# Altium schematic sheet DHT11.SchDoc
size 279 x 254 mm; SheetNumber: 1; SheetTotal: 1
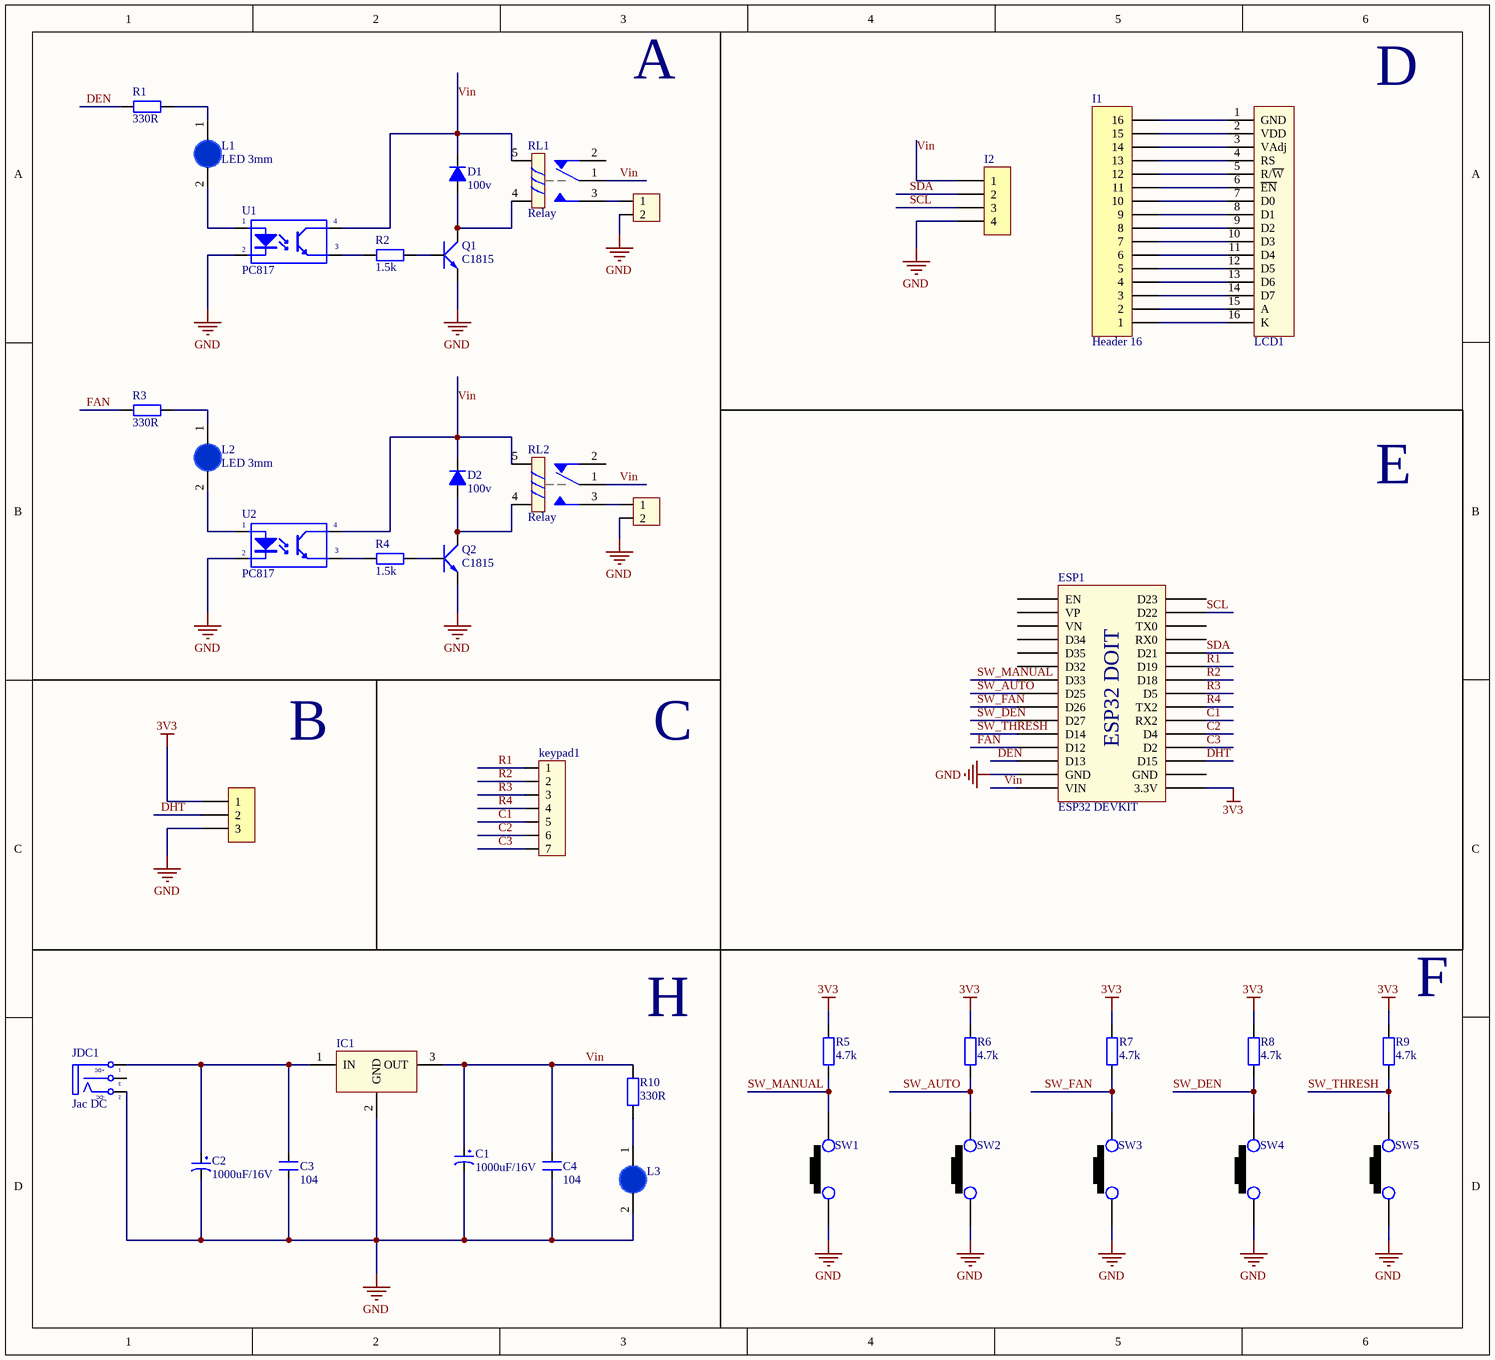
[diagram p0: DHT11.SchDoc]

## Parts
C1  1000uF/16V  [CP1.5/3.4]
C2  1000uF/16V  [CP1.5/3.4]
C3  104  [CN2]
C4  104  [CN2]
D1  100v  [DIODE 1A]
D2  100v  [DIODE 1A]
ESP1  ESP32 DEVKIT  [ESP32 WROOM 32 KIT]
H1  Header 2P 2.54 Duc Thang  [XH2.54M-2]  (value not drawn)
H2  Header 2P 2.54 Duc Thang  [XH2.54M-2]  (value not drawn)
H3  Header 3P 2.54 Duc Thang  [XH2.54M-3]  (value not drawn)
I1  Header 16  [HDR1X16]
I2  Header 4P 2.54 Duc Thang  [XH2.54M-4]  (value not drawn)
IC1  LM7805  [QTO-220]  (value not drawn)
JDC1  Jac DC  [DC-IN]
keypad1  Header 7P 2.54 Duc Thang  [XH2.54M-7]  (value not drawn)
L1  LED 3mm  [LED-3MM-BLUE]
L2  LED 3mm  [LED-3MM-BLUE]
L3  LED 3mm  [LED-3MM-BLUE]  (value not drawn)
LCD1  LCD1602 XL  [LCD1602 with Jump]  (value not drawn)
Q1  C1815  [TO92]
Q2  C1815  [TO92]
R1  330R  [tro vach 1/2w]
R2  1.5k  [tro vach 1/4w]
R3  330R  [tro vach 1/2w]
R4  1.5k  [tro vach 1/4w]
R5  4.7k  [tro vach 1/2w]
R6  4.7k  [tro vach 1/2w]
R7  4.7k  [tro vach 1/2w]
R8  4.7k  [tro vach 1/2w]
R9  4.7k  [tro vach 1/2w]
R10  330R  [tro vach 1/2w]
RL1  Relay  [Relay 5 Chan SRD]
RL2  Relay  [Relay 5 Chan SRD]
SW1  TACTILE SWITCH  [SW_342_SMD]  (value not drawn)
SW2  TACTILE SWITCH  [SW_342_SMD]  (value not drawn)
SW3  TACTILE SWITCH  [SW_342_SMD]  (value not drawn)
SW4  TACTILE SWITCH  [SW_342_SMD]  (value not drawn)
SW5  TACTILE SWITCH  [SW_342_SMD]  (value not drawn)
U1  PC817  [PC817]
U2  PC817  [PC817]

## Nets
3V3: ESP1.16(3.3V) H3.1 R5.2 R6.2 R7.2 R8.2 R9.2
GND: C1.2 C2.2 C3.1 C4.1 ESP1.14(GND) H1.2 H2.2 H3.3 I2.4 IC1.2(GND) JDC1.2(TN) L3.2(K) Q1.1(E) Q2.1(E) SW1.1 SW2.1 SW3.1 SW4.1 SW5.1 U1.2(K) U2.2(K)
C1: ESP1.21(RX2) keypad1.5
C2: ESP1.20(D4) keypad1.6
C3: ESP1.19(D2) keypad1.7
DEN: ESP1.13(D13) R1.1
DHT: ESP1.18(D15) H3.2
FAN: ESP1.12(D12) R3.1
R1: ESP1.25(D19) keypad1.1
R2: ESP1.24(D18) keypad1.2
R3: ESP1.23(D5) keypad1.3
R4: ESP1.22(TX2) keypad1.4
SCL: ESP1.29(D22) I2.3
SDA: ESP1.26(D21) I2.2
SW_AUTO: ESP1.8(D25) R6.1 SW2.2
SW_DEN: ESP1.10(D27) R8.1 SW4.2
SW_FAN: ESP1.9(D26) R7.1 SW3.2
SW_MANUAL: ESP1.7(D33) R5.1 SW1.2
SW_THRESH: ESP1.11(D14) R9.1 SW5.2
Vin: C1.1 C4.2 D1.2(K) D2.2(K) ESP1.15(VIN) I2.1 IC1.3(OUT) R10.1 RL1.1 RL1.5 RL2.1 RL2.5 U1.4(C) U2.4(C)
NetC2_1: C2.1 C3.2 IC1.1(IN) JDC1.1(T)
NetD1_1: D1.1(A) Q1.2(C) RL1.4
NetD2_1: D2.1(A) Q2.2(C) RL2.4
NetH1_1: H1.1 RL1.3
NetH2_1: H2.1 RL2.3
NetI1_1: I1.1 LCD1.16(K)
NetI1_2: I1.2 LCD1.15(A)
NetI1_3: I1.3 LCD1.14(D7)
NetI1_4: I1.4 LCD1.13(D6)
NetI1_5: I1.5 LCD1.12(D5)
NetI1_6: I1.6 LCD1.11(D4)
NetI1_7: I1.7 LCD1.10(D3)
NetI1_8: I1.8 LCD1.9(D2)
NetI1_9: I1.9 LCD1.8(D1)
NetI1_10: I1.10 LCD1.7(D0)
NetI1_11: I1.11 LCD1.6(~{EN})
NetI1_12: I1.12 LCD1.5(R/~{W})
NetI1_13: I1.13 LCD1.4(RS)
NetI1_14: I1.14 LCD1.3(VAdj)
NetI1_15: I1.15 LCD1.2(VDD)
NetI1_16: I1.16 LCD1.1(GND)
NetL1_1: L1.1(A) R1.2
NetL1_2: L1.2(K) U1.1(A)
NetL2_1: L2.1(A) R3.2
NetL2_2: L2.2(K) U2.1(A)
NetL3_1: L3.1(A) R10.2
NetQ1_3: Q1.3(B) R2.2
NetQ2_3: Q2.3(B) R4.2
NetR2_1: R2.1 U1.3(E)
NetR4_1: R4.1 U2.3(E)

Not connected (* = marked no-connect by the designer): ESP1 1(EN) 2(VP) 3(VN) 4(D34) 5(D35) 6(D32) 17(GND) 27(RX0) 28(TX0) 30(D23); JDC1 3(S); RL1 2; RL2 2

## Notes on the sheet
- A
- D
- E
- B
- C
- (near R10) H
- (near R9) F
- (in symbol DCIN) +DC; -DC
- (in symbol ESP32 WROOM 32 KIT) ESP32 DOIT

## Library data of the parts
C1 C2 = CP4: Cap 1000uF/16V - 220uF/50V; Description 5: 4,7uF>10uF/250V_3,3uF>10uF/400V - 2,2uF>4,7uF/450V; Description 1: 2200uF-3300uF/6,3V - 1000uF-2200uF/10V; Description 2: 1000uF/16V - 470uF => 1000uF/25V - 100uF/100V; Description 3: 330uF>470uF/35V_220uF>470uF/50V_10uF>22uF/250V; Description 4: 220uF => 330uF/63V - 10uF =>33uF/160 - 200V; Value: 1000uF/16V
C3 C4 = CN2: Cap np 104 => 105pF; Value: 0.1uF
D1 D2 = Diode 1N4007: Cắm; Ten_Linh_Kien: Diode 1N4007 1A (DIP); Don_Vi: Con; Ma_Hang: MH001063; Ghi Chu: *; Kieu_Chan: *; Chung_Loai: Cắm
ESP1 = ESP32 WROOM 32 KIT
H1 H2 = Header 2P 2.54 Duc Thang: Cắm; Ten_Linh_Kien: Header 2P XH2.54-2P Đực Thẳng; Don_Vi: Con; Ma_Hang: MH001283; Chung_Loai: Cắm
H3 = Header 3P 2.54 Duc Thang: Cắm; Ten_Linh_Kien: Header 3P XH2.54-3P Đực Thẳng; Don_Vi: Con; Ma_Hang: MH001292; Chung_Loai: Cắm
I1 = Header 16: Header, 16-Pin; LatestRevisionDate: 17-Jul-2002; LatestRevisionNote: Re-released for DXP Platform.; Publisher: Altium Limited
I2 = Header 4P 2.54 Duc Thang: Cắm; Ten_Linh_Kien: Header 4P XH2.54-4P Đực Thẳng; Don_Vi: Con; Ma_Hang: MH001285; Chung_Loai: Cắm
IC1 = LM78xx: On ap +, from + 5 to + 24VDC; Value: LM7805
JDC1 = DCIN: Jac DC input; Value: Jac DC
keypad1 = Header 7P 2.54 Duc Thang: Cắm; Ten_Linh_Kien: Header 7P XH2.54-7P Đực Thẳng; Don_Vi: Con; Ma_Hang: MH003369; Chung_Loai: Cắm
L1-L3 = LED 3mm Xanh Duong: Cắm; Don_Vi: Con; Ma_Hang: MH009003; Ten_Linh_Kien: LED 3MM Xanh Dương SS (1000c); Ghi_Chu: *; Kieu_Chan: *; Chung_Loai: Cắm
LCD1 = LCD1602 XL: LCD 1602 Xanh Lá; Ten: Màn hình LCD 1602 Xanh Lá; Ma_Hang: 67HZ; NCC: NSHOP; CHIP: HD44780
Q1 Q2 = Trans C1815 DIP: NPN transistor; Value: C9014
R1 R3 R10 = Tro Vach 1/2W 5% 330R: Cắm; Don_Vi: Con; So_Chan: 2; Ten_Linh_Kien: Trở 5% 1/2w 330R; Ma_Hang: MH006204; Chung_Loai: Cắm; Kieu_Chan: *
R2 R4 = Tro Vach 1/4W 5% 1.5k: Cắm; Don_Vi: Con; So_Chan: 2; Ten_Linh_Kien: Trở Vạch 1/4w 5% 1.5k; Ma_Hang: MH007284; Chung_Loai: Cắm; Kieu_Chan: *
R5-R9 = Tro Vach 1/2W 5% 4.7k: Cắm; Don_Vi: Con; So_Chan: 2; Ten_Linh_Kien: Trở 5% 1/2w 4.7k; Ma_Hang: MH006198; Chung_Loai: Cắm; Kieu_Chan: *
RL1 RL2 = Relay 5 Chan SRD: Relay 5 Chan; Ma_Hang: MH009374; Ten: Relay 5V10A SRD-05VDC-SL-C Chính Hãng
SW1-SW5 = SW1_RS-282G05A3-SMRT-SMD: Tactile Switch SPST-NO Top Actuated Surface Mount; Manufacturer: ITT C&K; Alternate Part Number-1: NA; Manufacturer Part Number: RS-282G05A3-SMRT; Case/Package: SMD; Supplier-1: SP ROAD; Supplier Part Number-1: RS-282G05A3-SMRT
U1 U2 = PC817_1: Single Opto; Value: PC817